# EAGLE design untitled (EAGLE 6.1)
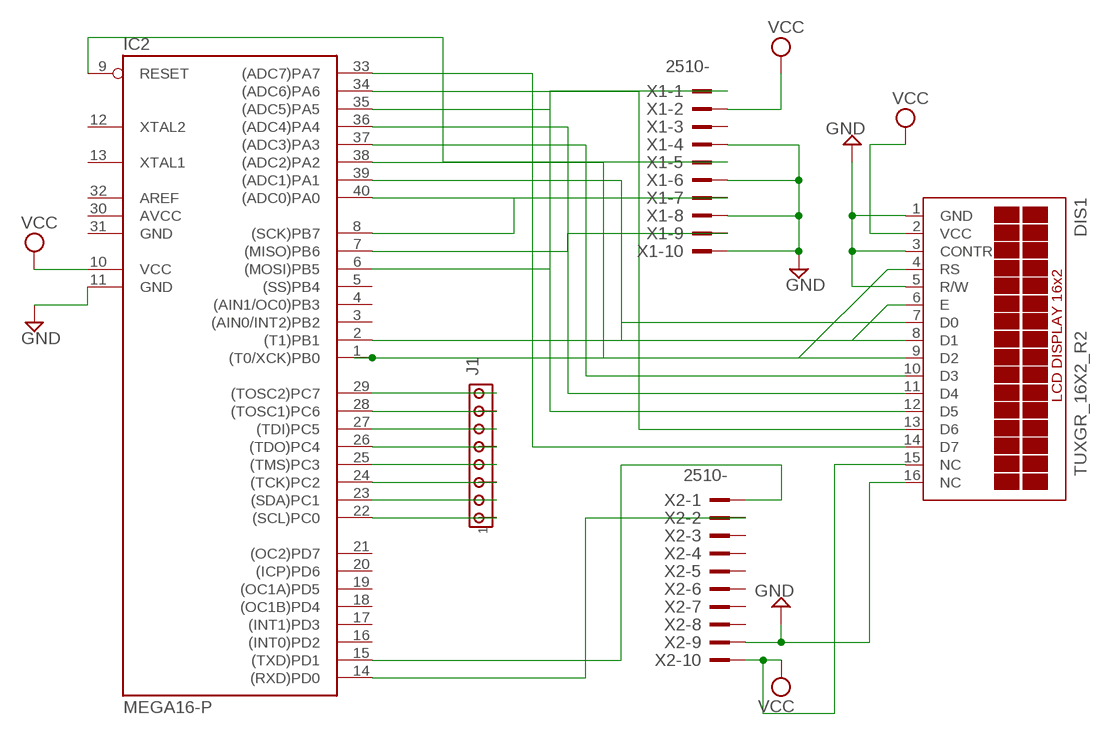
[diagram p0: schematic, sheet 1]

## Parts
DIS1  TUXGR_16X2_R2  [TUXGR_16X2_R2]
IC2  MEGA16-P  [DIL40]
J1  MTA08-100  [10X08MTA]
X1  2510-  [PAK100/2500-10]
X2  2510-  [PAK100/2500-10]

## Nets
GND: DIS1.1(GND) DIS1.3(CONTR) DIS1.5(R/W) DIS1.16(NC) IC2.11(GND) X1.4 X1.6 X1.8 X1.10 X2.9
N$1: IC2.15((TXD)PD1) X2.1
N$2: IC2.14((RXD)PD0) X2.2
N$3: IC2.6((MOSI)PB5) X1.1
N$4: IC2.7((MISO)PB6) X1.9
N$5: IC2.8((SCK)PB7) X1.7
N$6: IC2.9(RESET) X1.5
N$7: DIS1.7(D0) IC2.40((ADC0)PA0)
N$8: IC2.22((SCL)PC0) J1.1
N$9: IC2.23((SDA)PC1) J1.2
N$10: IC2.24((TCK)PC2) J1.3
N$11: IC2.25((TMS)PC3) J1.4
N$12: IC2.26((TDO)PC4) J1.5
N$13: IC2.27((TDI)PC5) J1.6
N$14: IC2.28((TOSC1)PC6) J1.7
N$15: IC2.29((TOSC2)PC7) J1.8
N$16: DIS1.8(D1) IC2.39((ADC1)PA1)
N$17: DIS1.9(D2) IC2.38((ADC2)PA2)
N$18: DIS1.10(D3) IC2.37((ADC3)PA3)
N$19: DIS1.11(D4) IC2.36((ADC4)PA4)
N$20: DIS1.12(D5) IC2.35((ADC5)PA5)
N$21: DIS1.13(D6) IC2.34((ADC6)PA6)
N$22: DIS1.14(D7) IC2.33((ADC7)PA7)
N$23: DIS1.4(RS) IC2.1((T0/XCK)PB0)
N$24: DIS1.6(E) IC2.2((T1)PB1)
VCC: DIS1.2(VCC) DIS1.15(NC) IC2.10(VCC) X1.2 X2.10
Unconnected: IC2.3((AIN0/INT2)PB2) IC2.4((AIN1/OC0)PB3) IC2.5((SS)PB4) IC2.12(XTAL2) IC2.13(XTAL1) IC2.16((INT0)PD2) IC2.17((INT1)PD3) IC2.18((OC1B)PD4) IC2.19((OC1A)PD5) IC2.20((ICP)PD6) IC2.21((OC2)PD7) IC2.32(AREF) X1.3 X2.3 X2.4 X2.5 X2.6 X2.7 X2.8

## Power pins joined to a net without a drawn wire
AVCC: IC2.30(AVCC)
GND: IC2.31(GND)

## Library data of the parts
DIS1 = display-lcd:TUXGR_16X2_R2: Tuxgraphics LCD display 16x2 characters reflective, without background light Source: tuxgr_12x2_r2.pdf; OC_FARNELL: unknown; OC_NEWARK: unknown
IC2 = atmel:MEGA16-P: MICROCONTROLLER 16 Kbytes FLASH 1 kbytes SRAM 512 bytes EEPROM USART 8-channel 10 bit ADC Source: avr.lbr; MPN: ATMEGA16-16PU; OC_FARNELL: 9171142; OC_NEWARK: 01M6885
J1 = con-amp:MTA08-100: AMP connector
X1 X2 = con-3m:2510-: 3M (TM) Pak 100 4-Wall Header Source: 3M; MF: 3M; MPN: 2510-6002UB; OC_FARNELL: 9838244; OC_NEWARK: 46F4725

## Board
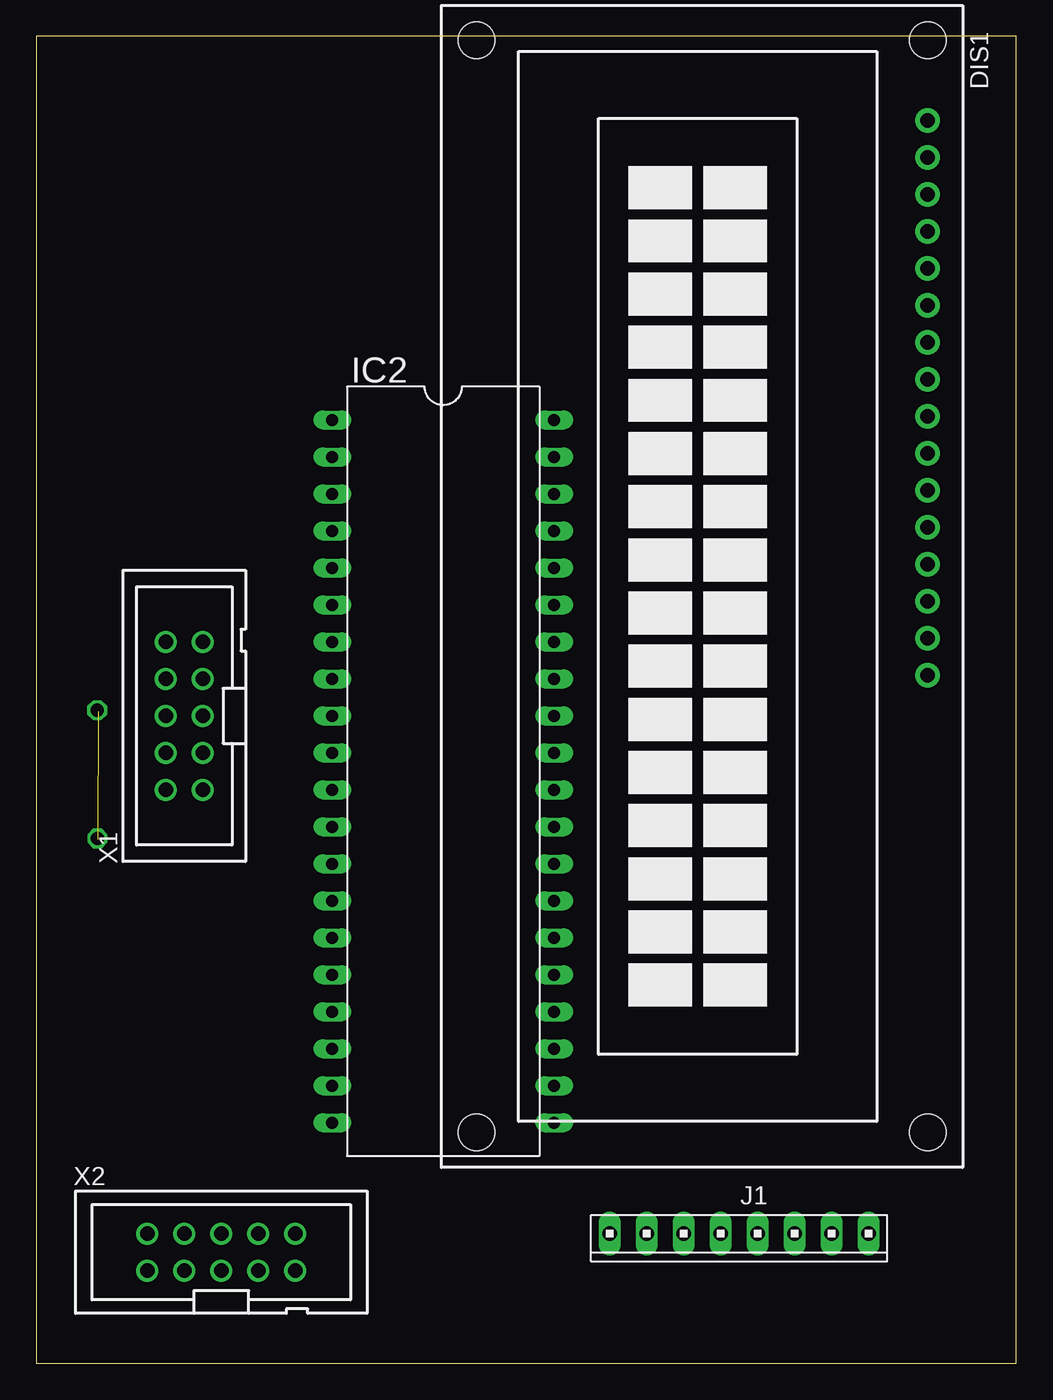
[diagram p1: board, top side]
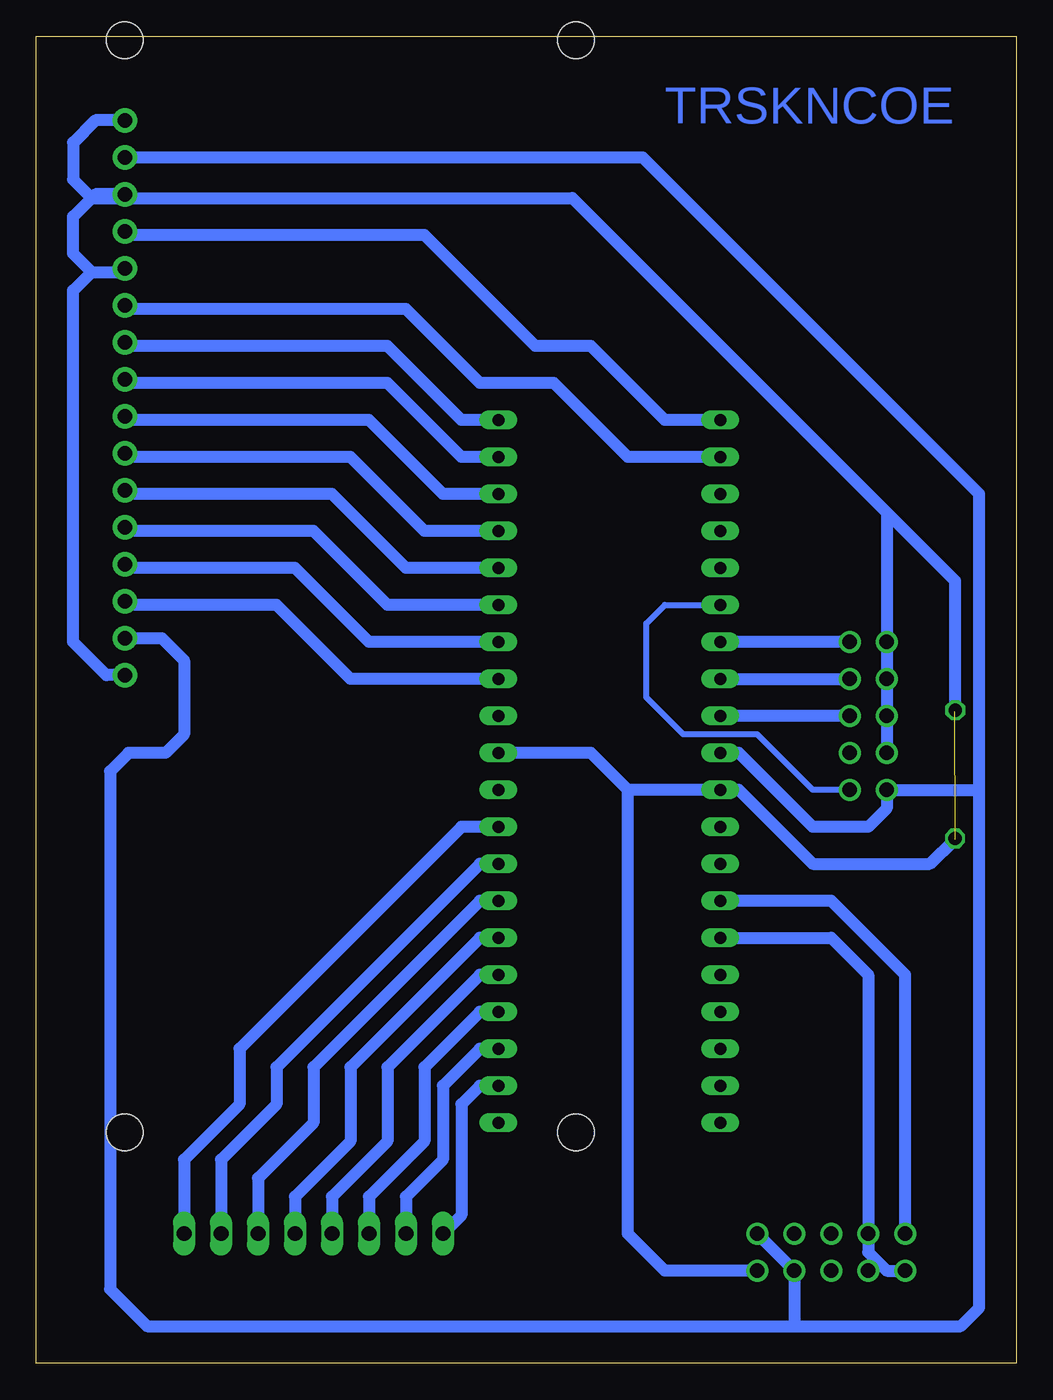
[diagram p2: board, bottom side, seen from below]

Size 67.29 x 91.11 mm. Coordinates in mm from the lower left corner, seen from the top.
Outline: 0,0 67.29,0 67.29,91.11 0,91.11 0,0
Copper layers (1*16): Top 0.035mm / dielectric 1.5mm / Bottom 0.035mm
Design rules: minimum track width 10mil, minimum drill 24mil, track to track 8mil, track to pad 8mil, pad to pad 8mil, via to via 8mil, smd to smd 8mil, copper to edge 40mil, drill to drill 8mil, minimum pad ring 10mil, minimum via ring 8mil, stop-mask expansion 4mil, vias tented up to drill 0mil, thermal gap 10mil

### Footprints (pad centres in the part's own frame; a part is rotated, then mirrored left to right if it is on the bottom)
TUXGR_16X2_R2 = drill 1 pad 1.676: 1 -32,15.5; 2 -29.46,15.5; 3 -26.92,15.5; 4 -24.38,15.5; 5 -21.84,15.5; 6 -19.3,15.5; 7 -16.76,15.5; 8 -14.22,15.5; 9 -11.68,15.5; 10 -9.14,15.5; 11 -6.6,15.5; 12 -4.06,15.5; 13 -1.52,15.5; 14 1.02,15.5; 15 3.56,15.5; 16 6.1,15.5 | hole 2.5: -37.5,-15.5; 37.5,-15.5; -37.5,15.5; 37.5,15.5
DIL40 = drill 0.813 long: 1 -24.13,-7.62; 2 -21.59,-7.62; 3 -19.05,-7.62; 4 -16.51,-7.62; 5 -13.97,-7.62; 6 -11.43,-7.62; 7 -8.89,-7.62; 8 -6.35,-7.62; 9 -3.81,-7.62; 10 -1.27,-7.62; 11 1.27,-7.62; 12 3.81,-7.62; 13 6.35,-7.62; 14 8.89,-7.62; 15 11.43,-7.62; 16 13.97,-7.62; 17 16.51,-7.62; 18 19.05,-7.62; 19 21.59,-7.62; 20 24.13,-7.62; 21 24.13,7.62; 22 21.59,7.62; 23 19.05,7.62; 24 16.51,7.62; 25 13.97,7.62; 26 11.43,7.62; 27 8.89,7.62; 28 6.35,7.62; 29 3.81,7.62; 30 1.27,7.62; 31 -1.27,7.62; 32 -3.81,7.62; 33 -6.35,7.62; 34 -8.89,7.62; 35 -11.43,7.62; 36 -13.97,7.62; 37 -16.51,7.62; 38 -19.05,7.62; 39 -21.59,7.62; 40 -24.13,7.62
10X08MTA = drill 1.016 long: 1 8.89,0; 2 6.35,0; 3 3.81,0; 4 1.27,0; 5 -1.27,0; 6 -3.81,0; 7 -6.35,0; 8 -8.89,0
PAK100/2500-10 = drill 1 pad 1.422: 1 -5.08,-1.27; 2 -5.08,1.27; 3 -2.54,-1.27; 4 -2.54,1.27; 5 0,-1.27; 6 0,1.27; 7 2.54,-1.27; 8 2.54,1.27; 9 5.08,-1.27; 10 5.08,1.27

### Placement (x,y rotation side)
DIS1  45.72,53.34 270 top
IC2  27.94,40.64 270 top
J1  48.26,8.89 180 top
X1  10.16,44.45 90 top
X2  12.7,7.62 0 top

### Tracks (layer width: path | path; a pad name or v marks a point on that pad's centre or on a via)
GND  (1 unrouted)
  Bottom 0.813: X1.4 X1.6 X1.8 X1.10 8.89,58.42 | DIS1.1 63.25,85.34 64.77,83.82 64.77,81.28 63.5,80.01 | 63.5,80.01 61.47,80.01 | 61.47,80.01 DIS1.3 63.25,80.26 63.5,80.01 | 63.5,74.93 61.47,74.93 DIS1.5 | 26.67,39.37 IC2.11 19.05,39.37 13.97,34.29 5.93,34.29 4.2,35.95 | 26.67,39.37 29.21,41.91 IC2.31 | X2.9 24.13,6.35 26.67,8.89 26.67,39.37 | DIS1.16 62.48,47.24 64.77,49.53 64.77,73.66 63.5,74.93 | 63.5,74.93 64.77,76.2 64.77,78.74 63.5,80.01 | 61.47,80.01 30.48,80.01 8.89,58.42 | 8.89,58.42 4.2,53.73 4.2,44.79 4.23,44.76
N$1
  Bottom 0.813: IC2.15 12.7,29.21 10.16,26.67 10.16,7.62 8.89,6.35 X2.1
N$2
  Bottom 0.813: X2.2 7.62,26.67 12.7,31.75 IC2.14
N$3
  Bottom 0.406: X1.1 13.97,39.37 17.78,43.18 22.86,43.18 25.4,45.72 25.4,50.8 24.13,52.07 IC2.6
N$4
  Bottom 0.813: X1.9 IC2.7
N$5
  Bottom 0.813: IC2.8 X1.7
N$6
  Bottom 0.813: X1.5 IC2.9
N$7
  Bottom 0.813: IC2.40 38.1,64.77 43.18,69.85 60.97,69.85 DIS1.7
N$8
  Bottom 0.813: IC2.22 36.83,19.05 38.1,17.78 38.1,10.16 J1.1
N$9
  Bottom 0.813: IC2.23 36.83,21.59 39.37,19.05 39.37,13.97 41.91,11.43 J1.2
N$10
  Bottom 0.813: IC2.24 36.83,24.13 40.64,20.32 40.64,15.24 44.45,11.43 J1.3
N$11
  Bottom 0.813: IC2.25 36.83,26.67 43.18,20.32 43.18,15.24 46.99,11.43 J1.4
N$12
  Bottom 0.813: IC2.26 36.83,29.21 45.72,20.32 45.72,15.24 49.53,11.43 J1.5
N$13
  Bottom 0.813: IC2.27 36.83,31.75 48.26,20.32 48.26,16.51 52.07,12.7 J1.6
N$14
  Bottom 0.813: IC2.28 36.83,34.29 50.8,20.32 50.8,17.78 54.61,13.97 J1.7
N$15
  Bottom 0.813: IC2.29 38.1,36.83 53.34,21.59 53.34,17.78 57.15,13.97 J1.8
N$16
  Bottom 0.813: IC2.39 38.1,62.23 43.18,67.31 60.97,67.31 DIS1.8
N$17
  Bottom 0.813: IC2.38 39.37,59.69 44.45,64.77 60.97,64.77 DIS1.9
N$18
  Bottom 0.813: IC2.37 40.64,57.15 45.72,62.23 60.97,62.23 DIS1.10
N$19
  Bottom 0.813: IC2.36 41.91,54.61 46.99,59.69 60.97,59.69 DIS1.11
N$20
  Bottom 0.813: IC2.35 43.18,52.07 48.26,57.15 60.97,57.15 DIS1.12
N$21
  Bottom 0.813: IC2.34 44.45,49.53 49.53,54.61 60.97,54.61 DIS1.13
N$22
  Bottom 0.813: IC2.33 45.72,46.99 50.8,52.07 60.97,52.07 DIS1.14
N$23
  Bottom 0.813: IC2.1 24.13,64.77 29.21,69.85 33.02,69.85 40.64,77.47 60.97,77.47 DIS1.4
N$24
  Bottom 0.813: IC2.2 26.67,62.23 31.75,67.31 36.83,67.31 41.91,72.39 60.97,72.39 DIS1.6
N$25  (via drill 0.9)
  other vias: 4.2,36.03
N$26  (via drill 0.9)
  other vias: 4.18,44.83
VCC
  Bottom 0.813: DIS1.15 58.67,49.78 57.15,48.26 57.15,43.18 58.42,41.91 60.96,41.91 62.23,40.64 62.23,5.08 59.69,2.54 15.24,2.54 | 15.24,2.54 3.81,2.54 2.54,3.81 2.54,39.37 | 2.54,39.37 2.54,59.69 25.65,82.8 DIS1.2 | X2.10 15.24,6.35 15.24,2.54 | 2.54,39.37 X1.2 8.89,38.1 10.16,36.83 13.97,36.83 19.05,41.91 IC2.10

### Text on the board
Bottom: TRSKNCOE